# EAGLE design Callisto_Minor_Relays_v1p0 (EAGLE 9.6.2)
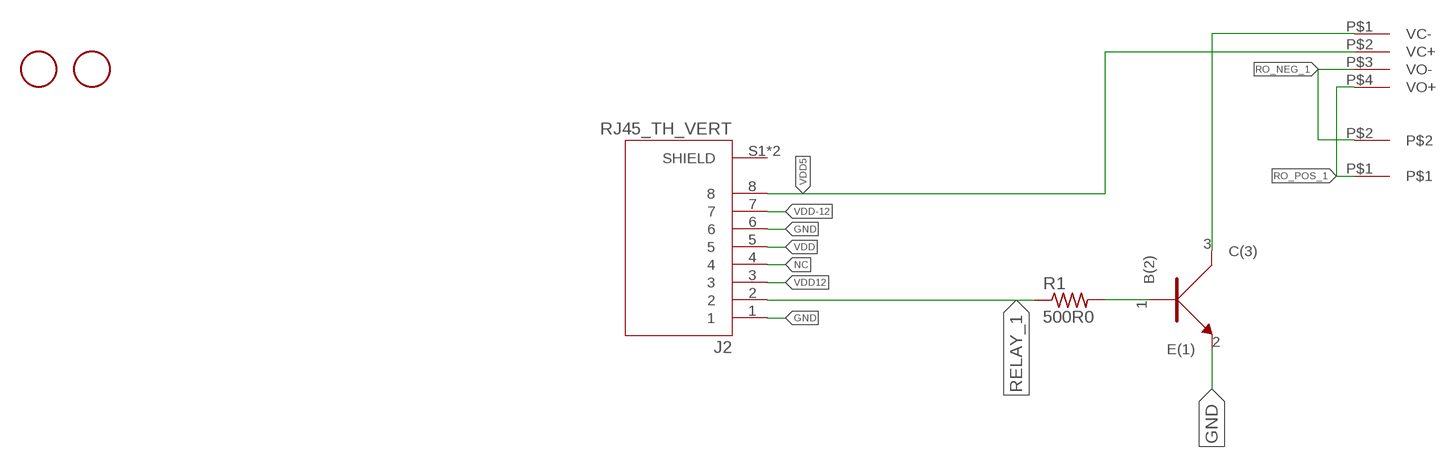
[diagram p0: schematic, sheet 1]

## Parts
J1  2-pos  3.81MM_1_X_2_RT_ANGLE_PLUG_HEADER  [2_3.81MM_PITCH]
J2  RJ45_TH_VERT  [ASSMANN_A-2014-2S-4-N-R]
R1  500R0  R_0402  [0402]
U2  NPN  BC846BW  [SOT323]
U$1  FIDUCIAL_1MM  [FIDUCIAL_1MM]
U$2  FIDUCIAL_1MM  [FIDUCIAL_1MM]
U$3  RELAY_KYOTO_KF0604D  [RELAY_KYOTO_KF0604D]

## Nets
GND: J2.1 J2.6 U2.2(E(1))
N$2: R1.P$2 U2.1(B(2))
N$3: U2.3(C(3)) U$3.P$1(VC-)
NC: J2.4
RELAY_1: J2.2 R1.P$1
RO_NEG_1: J1.P$2 U$3.P$3(VO-)
RO_POS_1: J1.P$1 U$3.P$4(VO+)
VDD: J2.5
VDD5: J2.8 U$3.P$2(VC+)
VDD12: J2.3
VDD-12: J2.7
Unconnected: J2.S1(SHIELD) J2.S2(SHIELD)

## Library data of the parts
J1 = 3D_MIG_Controller:3.81MM_1_X_2_RT_ANGLE_PLUG_HEADER: TERM BLOCK HDR 2POS 90DEG 3.81MM; PARTNO: 691322310002
J2 = 3D_MIG_Controller:RJ45_TH_VERT: Jack Modular Connector 8p8c (RJ45, Ethernet) Vertical Shielded; DESCRIPTION: Jack Modular Connector 8p8c (RJ45, Ethernet) Vertical Shielded; DIGI-KEY_PART_NUMBER: AE10399-ND; MF: Assmann WSW Components; MP: A-2014-2S-4-N-R; PACKAGE: None
R1 = 3D_MIG_Controller:R_0402
U2 = 3D_MIG_Controller:BC846BW: Bipolar (BJT) Transistor NPN 100MHz Surface Mount SOT-323; PARTNO: BC846BW_NPN
U$1 U$2 = 3D_MIG_Controller:FIDUCIAL_1MM: For use by pick and place machines to calibrate the vision/machine, 1mm By microbuilder.eu
U$3 = 3D_MIG_Controller:RELAY_KYOTO_KF0604D

## Board
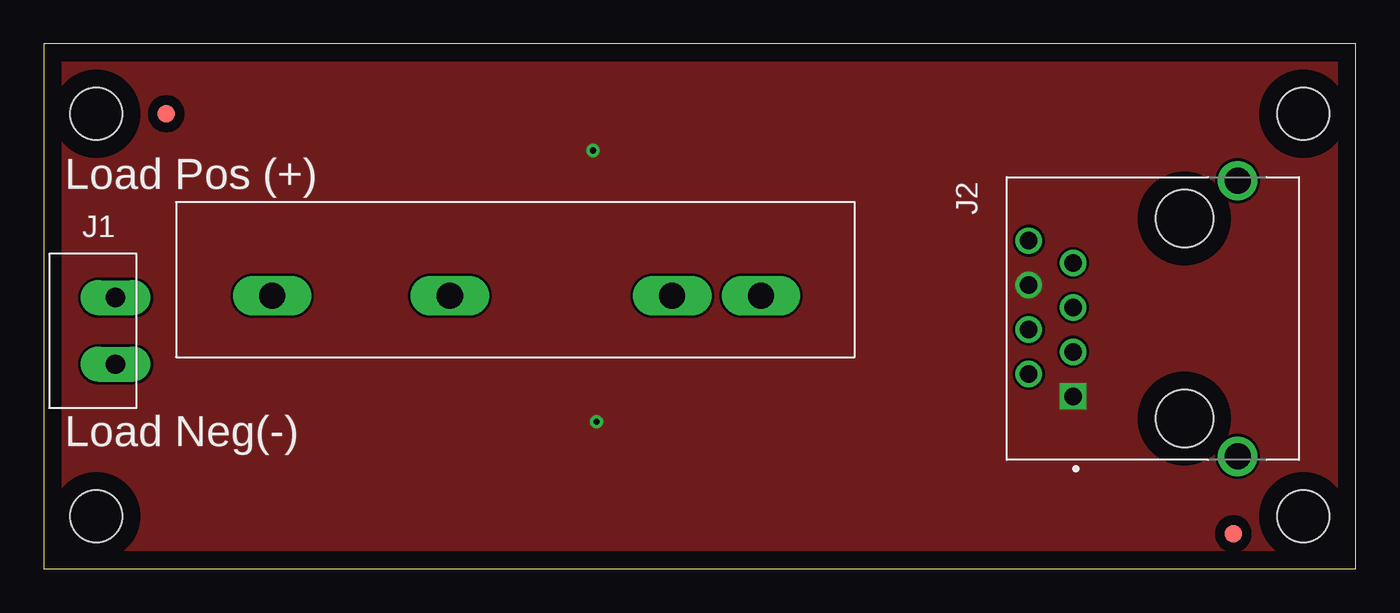
[diagram p1: board, top side]
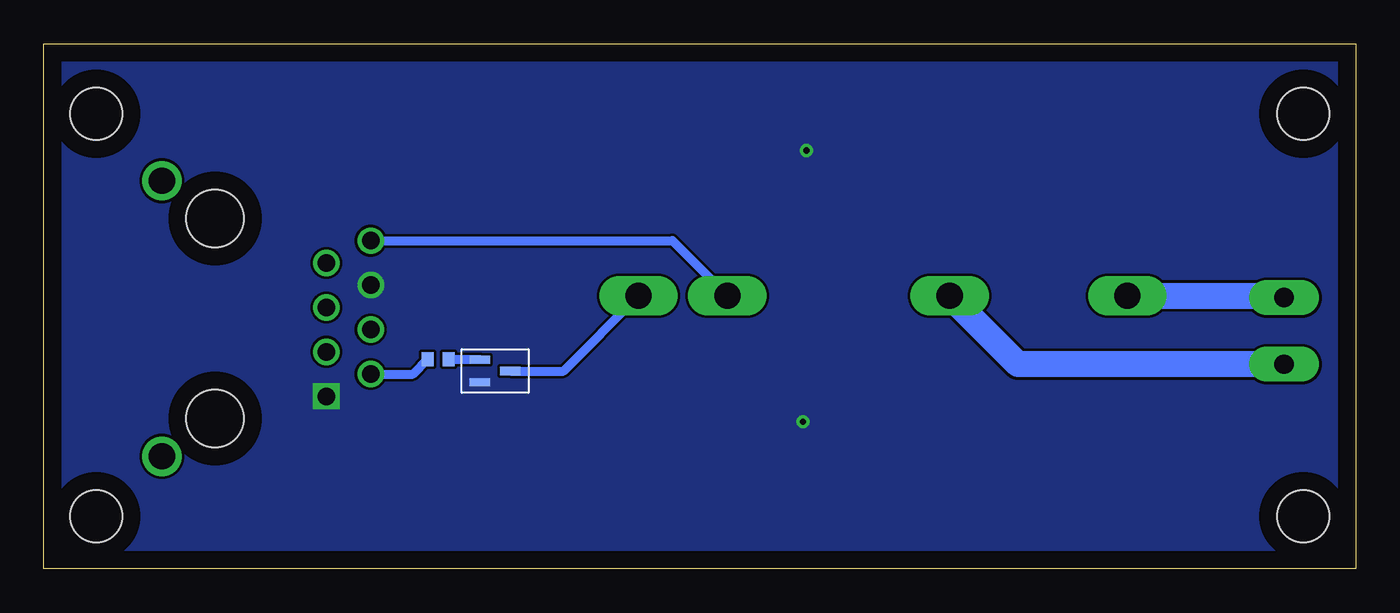
[diagram p2: board, bottom side, seen from below]

Size 75 x 30 mm. Coordinates in mm from the lower left corner, seen from the top.
Outline: 0,0 75,0 75,30 0,30 0,0
Copper layers (1*16): Top 0.035mm / dielectric 1.5mm / Bottom 0.035mm
Design rules "default": minimum track width 6mil, minimum drill 0.35mm, track to track 6mil, track to pad 6mil, pad to pad 6mil, via to via 6mil, smd to smd 6mil, copper to edge 40mil, drill to drill 6mil, minimum pad ring 10mil, minimum via ring 8mil, stop-mask expansion 4mil, vias tented up to drill 0mil, thermal gap 10mil
Holes 3 mm at 72,26 3,26 72,3 3,3

### Footprints (pad centres in the part's own frame; a part is rotated, then mirrored left to right if it is on the bottom)
2_3.81MM_PITCH = drill 1.1 pad 2 long: P$1 0,0; P$2 3.81,0
ASSMANN_A-2014-2S-4-N-R = drill 1 square: 1 4.445,-6.35 | drill 1: 2 3.175,-8.89; 3 1.905,-6.35; 4 0.635,-8.89; 5 -0.635,-6.35; 6 -1.905,-8.89; 7 -3.175,-6.35; 8 -4.445,-8.89 | drill 1.5: S1 -7.875,3.05; S2 7.875,3.05 | hole 3.3: -5.715,0; 5.715,0
0402 = smd 0.8 x 0.7: P$1 0,0.6; P$2 0,-0.6
SOT323 = smd 0.457 x 1.168: 1 -0.65,-0.876; 2 0.65,-0.876; 3 0,0.876
FIDUCIAL_1MM = smd 1 x 1: 1 0,0
RELAY_KYOTO_KF0604D = drill 1.5 long: P$1 0,0; P$2 -5.08,0; P$3 -17.78,0; P$4 -27.94,0

### Placement (x,y rotation side)
J1  4.1,15.5 270 top
J2  65.2,14.3 270 top
R1  52.46,11.96 90 bottom
U2  49.2,11.3 270 bottom
U$1  7,26 0 top
U$2  68,2 0 top
U$3  41,15.6 0 top

### Tracks (layer width: path | path; a pad name or v marks a point on that pad's centre or on a via)
GND  (via drill 0.35)
  other vias: 31.4,23.9 31.6,8.4
  pour Top (no thermals): 0,30 75,30 75,0 0,0
  pour Bottom (no thermals): 0,30 75,30 75,0 0,0
N$2
  Bottom 0.508: R1.P$2 U2.1
N$3
  Bottom 0.508: U2.3 45.3,11.3 U$3.P$1
RELAY_1
  Bottom 0.508: J2.2 53.9,11.12 R1.P$1
RO_NEG_1
  Bottom 1.5: J1.P$2 19.31,11.69 U$3.P$3
RO_POS_1
  Bottom 1.5: U$3.P$4 4.2,15.6 J1.P$1
VDD5
  Bottom 0.508: J2.8 39.06,18.75 U$3.P$2

### Text on the board
tPlace: Load Pos (+) | Load Neg(-)